# EAGLE design d32 (EAGLE 9.6.2)
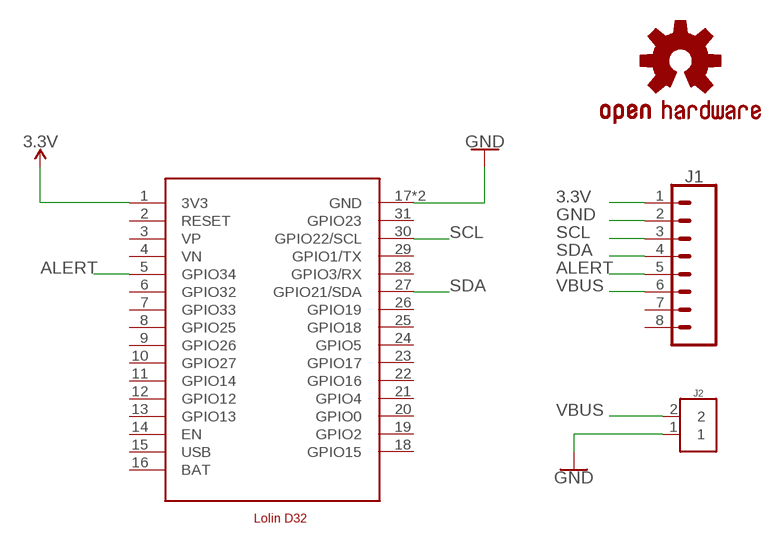
[diagram p0: schematic, sheet 1]

## Parts
J1  CONN_08NO_SILK_FEMALE_PTH  [1X08_NO_SILK]
J2  282834-2  [CONN_282834-2]
LOGO1  OSHW-LOGOS  [OSHW-LOGO-S]
U1  LOLIND32  [LOLIND32]

## Nets
3.3V [signal]: J1.1 U1.1(3V3)
ALERT [signal]: J1.5 U1.5(GPIO34)
GND [signal]: J1.2 J2.1 U1.17(GND) U1.32(GND)
SCL [signal]: J1.3 U1.30(GPIO22/SCL)
SDA [signal]: J1.4 U1.27(GPIO21/SDA)
VBUS [signal]: J1.6 J2.2
Unconnected: J1.7 J1.8 U1.2(RESET) U1.3(VP) U1.4(VN) U1.6(GPIO32) U1.7(GPIO33) U1.8(GPIO25) U1.9(GPIO26) U1.10(GPIO27) U1.11(GPIO14) U1.12(GPIO12) U1.13(GPIO13) U1.14(EN) U1.18(GPIO15) U1.19(GPIO2) U1.20(GPIO0) U1.21(GPIO4) U1.22(GPIO16) U1.23(GPIO17) U1.24(GPIO5) U1.25(GPIO18) U1.26(GPIO19) U1.28(GPIO3/RX) U1.29(GPIO1/TX) U1.31(GPIO23)

## Power pins joined to a net without a drawn wire
BAT: U1.16(BAT)
USB: U1.15(USB)

## Library data of the parts
J1 = SparkFun-Connectors:CONN_08: Multi connection point. Often used as Generic Header-pin footprint for 0.1 inch spaced/style header connections On any of the 0.1 inch spaced packages, you can populate with these: Break Away Headers - Straight <https://www.sparkfun.com/products/116> (PRT-00116) Break Away Male Headers - Right Angle <https://www.sparkfun.com/products/553> (PRT-00553) Female Headers <https://www.sparkfun.com/products/115> (PRT-00115) Break Away Headers - Machine Pin <https://www.sparkfun.com/products/117> (PRT-00117) Break Away Female Headers - Swiss Machine Pin <https://www.sparkfun.com/products/743> (PRT-00743) Arduino Stackable Header - 8 Pin <https://www.sparkfun.com/products/9279> (PRT-09279) For SCREWTERMINALS and SPRING TERMINALS visit here: Screw Terimnals on SparkFun.com <https://www.sparkfun.com/search/results?term=Screw+Terminals> (5mm/3.5mm/2.54mm spacing) This device is also useful as a general connection point to wire up your design to another part of your project. Our various solder wires solder well into these plated through hole pads. Hook-Up Wire - Assortment (Stranded, 22 AWG) <https://www.sparkfun.com/products/11375> (PRT-11375) Hook-Up Wire - Assortment (Solid Core, 22 AWG) <https://www.sparkfun.com/products/11367> (PRT-11367) View the entire wire category on our website here <https://www.sparkfun.com/categories/141> Special notes: Molex polarized connector foot print use with SKU : PRT-08231 with associated crimp pins and housings. 1MM SMD Version SKU: PRT-10208 NOTES ON THE VARIANTS LOCK and LOCK_LONGPADS... This footprint was designed to help hold the alignment of a through-hole component (i.e. 6-pin header) while soldering it into place. You may notice that each hole has been shifted either up or down by 0.005 of an inch from it's more standard position (which is a perfectly straight line). This slight alteration caused the pins (the squares in the middle) to touch the edges of the holes. Because they are alternating, it causes a "brace" to hold the component in place. 0.005 has proven to be the perfect amount of "off-center" position when using our standard breakaway headers. Although looks a little odd when you look at the bare footprint, once you have a header in there, the alteration is very hard to notice. Also,if you push a header all the way into place, it is covered up entirely on the bottom side.; PROD_ID: CONN-08438
J2 = 282834-2:282834-2: Terminal block; 2.54mm; angled 90°; 0.03÷1mm2; ways: 2; 10A; H: 10mm Check prices <https://pricing.snapeda.com/parts/282834-2/TE%20Connectivity/view-part?ref=eda>; AVAILABILITY: Good; CENTERLINE_PITCH: 2.54 mm[.1 in]; COMMENT: 282834-2; DESCRIPTION: Wire-To-Board Terminal Block, 2, 150 V, 10 A, 30 Awg, 16 Awg, 1.4 Mm; EU_ROHS_COMPLIANCE: Compliant with Exemptions; MF: TE Connectivity; MP: 282834-2; NUMBER_OF_POSITIONS: 2; PACKAGE: None; PRICE: None; PURCHASE-URL: https://pricing.snapeda.com/search/part/282834-2/?ref=eda
LOGO1 = SparkFun-Aesthetics:OSHW-LOGO: Open-Source Hardware (OSHW) Logo This logo indicates the piece of hardware it is found on incorporates a OSHW license and/or adheres to the definition of open source hardware found here: http://freedomdefined.org/OSHW
U1 = microcontroller:LOLIND32: Wemos Lolin D32 Lolin D32 is a development board based on ESP32. On this schematic, this board is designed with battery port. Pins VP and VN are Not Connected pins.

## Net classes
0 default: clearance 0.152 mm
2 signal: width 0.203 mm

## Board
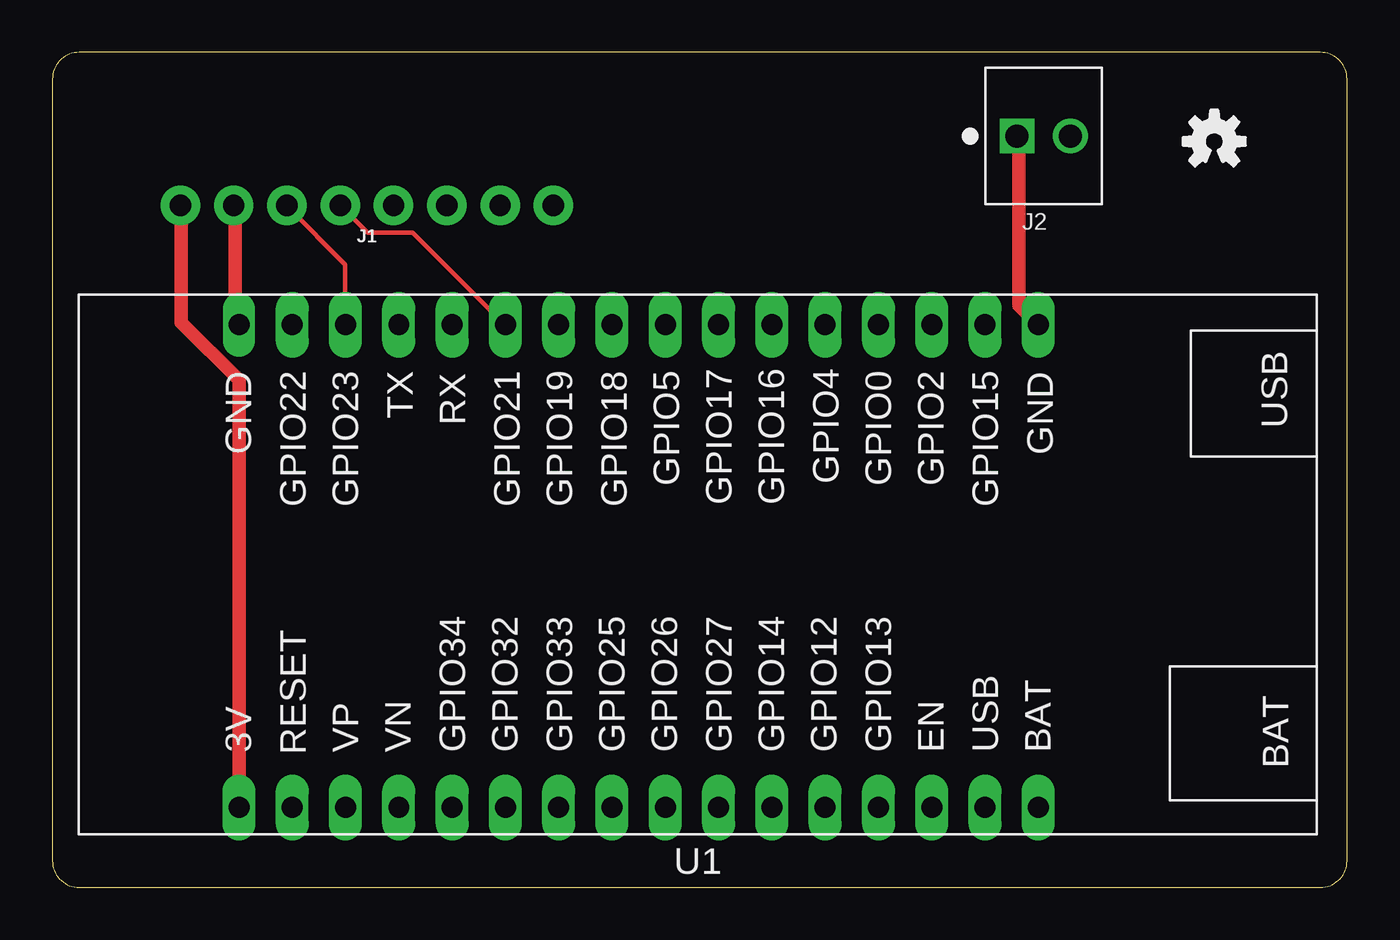
[diagram p1: board, top side]
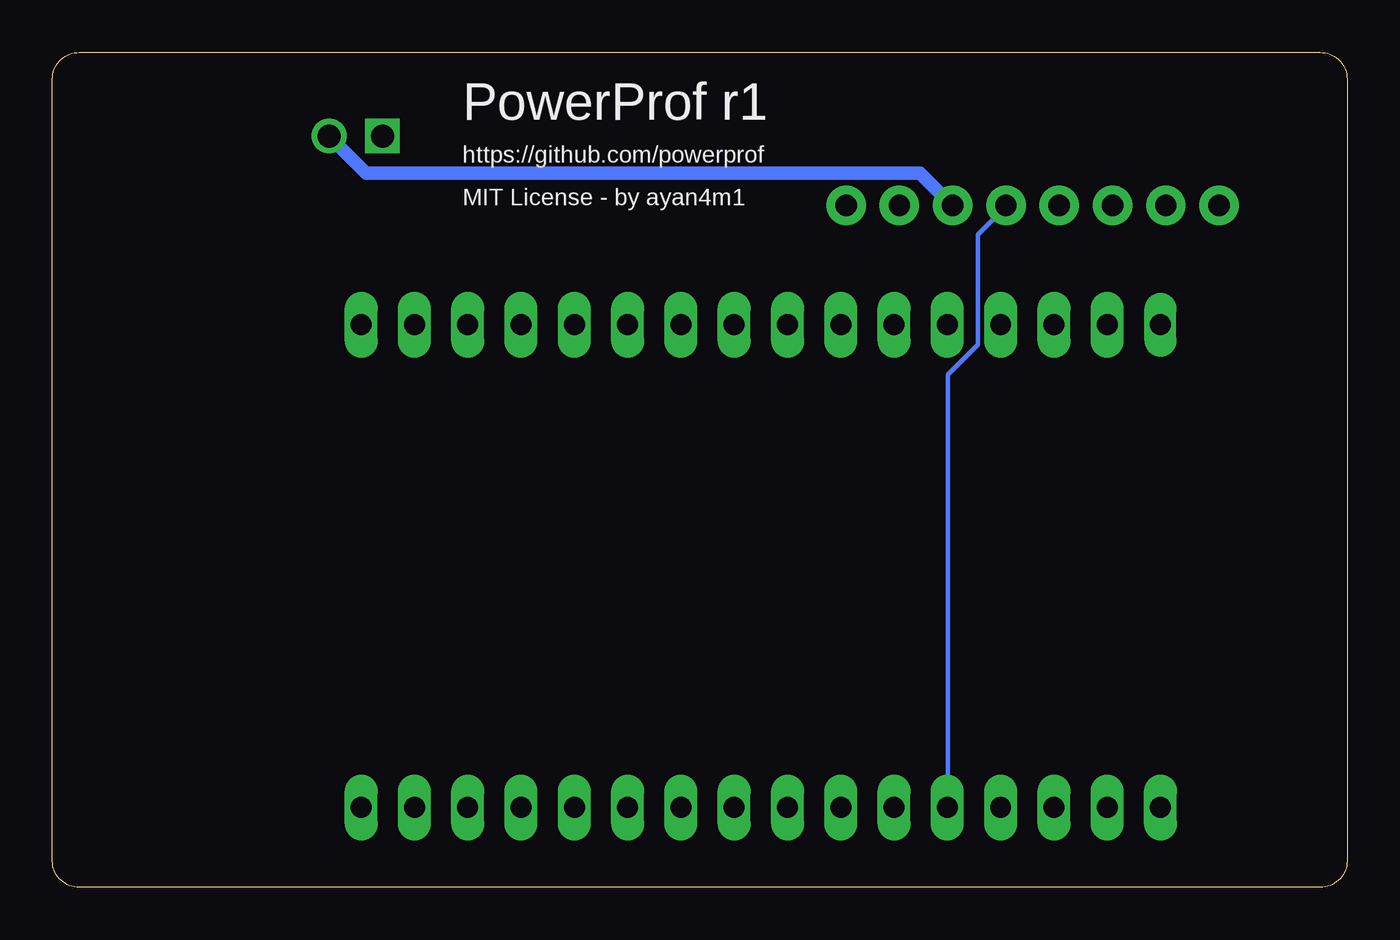
[diagram p2: board, bottom side, seen from below]

Size 61.7 x 39.8 mm. Coordinates in mm from the lower left corner, seen from the top.
Outline: 0,38.53 0,1.27 arc90 1.27,0 60.43,0 arc90 61.7,1.27 61.7,38.53 arc90 60.43,39.8 1.27,39.8 arc90 0,38.53
Copper layers (1*16): Top 0.035mm / dielectric 0.15mm / Bottom 0.035mm
Design rules "default *": minimum track width 6mil, minimum drill 0.35mm, track to track 8mil, track to pad 8mil, pad to pad 8mil, via to via 8mil, smd to smd 8mil, copper to edge 40mil, drill to drill 6mil, minimum pad ring 10mil, minimum via ring 8mil, stop-mask expansion 4mil, vias tented up to drill 0mil, thermal gap 10mil

### Footprints (pad centres in the part's own frame; a part is rotated, then mirrored left to right if it is on the bottom)
1X08_NO_SILK = drill 1.016 pad 1.88: 1 0,0; 2 2.54,0; 3 5.08,0; 4 7.62,0; 5 10.16,0; 6 12.7,0; 7 15.24,0; 8 17.78,0
CONN_282834-2 = drill 1.1 square: 1 -1.27,0 | drill 1.1: 2 1.27,0
LOLIND32 = drill 1 pad 1.575 long: 1 -11.43,21.59; 2 -11.43,19.05; 3 -11.43,16.51; 4 -11.43,13.97; 5 -11.43,11.43; 6 -11.43,8.89; 7 -11.43,6.35; 8 -11.43,3.81; 9 -11.43,1.27; 10 -11.43,-1.27; 11 -11.43,-3.81; 12 -11.43,-6.35; 13 -11.43,-8.89; 14 -11.43,-11.43; 15 -11.43,-13.97; 16 -11.43,-16.51; 17 11.58,-16.51; 18 11.58,-13.97; 19 11.58,-11.43; 20 11.58,-8.89; 21 11.58,-6.35; 22 11.58,-3.81; 23 11.58,-1.27; 24 11.58,1.27; 25 11.58,3.81; 26 11.58,6.35; 27 11.58,8.89; 28 11.58,11.43; 29 11.58,13.97; 30 11.58,16.51; 31 11.58,19.05 | drill 1 pad 1.524 long: 32 11.58,21.59

### Placement (x,y rotation side)
J1  6.1,32.51 0 top
J2  47.24,35.81 0 top
LOGO1  55.37,35.56 0 top
U1  30.48,15.24 90 top

### Tracks (layer width: path | path; a pad name or v marks a point on that pad's centre or on a via)
3.3V
  Top 0.635: U1.1 8.89,24.18 6.13,26.94 6.13,32.45 J1.1
ALERT
  Bottom 0.203: U1.5 19.02,3.82 19.02,24.45 17.6,25.87 17.6,31.11 16.27,32.45 J1.5
GND
  Top 0.635: J2.1 46.05,35.74 46.05,27.74 46.94,26.85 U1.17 | J1.2 8.71,32.45 8.71,27.03 8.89,26.85 U1.32
SCL
  Top 0.203: U1.30 13.96,26.85 13.96,29.69 11.2,32.45 J1.3
SDA
  Top 0.203: J1.4 15.02,31.2 17.16,31.2 21.51,26.85 U1.27
VBUS
  Bottom 0.635: J2.2 48.45,35.74 46.76,34.05 20.36,34.05 18.85,32.54 J1.6

### Text on the board
bNames: PowerProf r1 | https://github.com/powerprof | MIT License - by ayan4m1